# Altium schematic sheet lcd.SchDoc: DE:TMP:11:UC:EXPANDIDO
size 208 x 137 mm; Date: 21-07-2022; SheetNumber: 1; SheetTotal: 1; WebFGR: www.abebashop.com; VersionFGR: 20220721; PageSetup: Record=PageOptions|CenterHorizontal=True|CenterVertical=True|PrintScale=0.94|XCorrection=1.00|YCorrection=1.00|PrintKind=0|BorderSize=5000000|LeftOffset=0|BottomOffset=0|Orientation=2|PaperLength=1000|PaperWidth=1000|Scale=100|PaperSource=7|PrintQuality=-4|MediaType=1|DitherType=10|PaperKind=Letter|PrintScaleMode=1
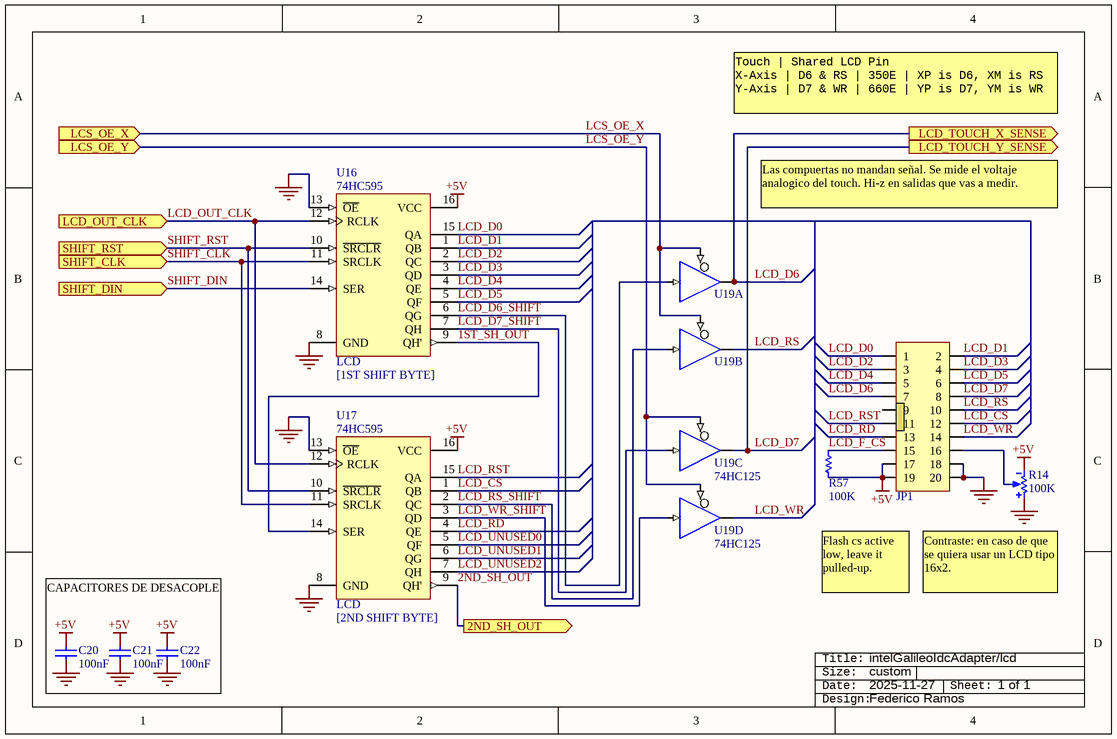
[diagram p0: lcd.SchDoc]

## Parts
C20  value 100nF  [c1206]  (hidden comment: Cap)
C21  value 100nF  [c1206]  (hidden comment: Cap)
C22  value 100nF  [c1206]  (hidden comment: Cap)
JP1  IDC 10x2  [idc10x2]  (value not drawn)
R14  value 100K  [PRESET6]  (hidden comment: Preset)
R57  Resistencia: 100K  [R1206]  (hidden comment: Resistencia 1206; 1Kohm)
ROT?  Rotulo_empty  (value not drawn)  (graphical)
U16  74HC595  [DIP16]
U17  74HC595  [DIP16]
U19  74HC125  [DIP14]  (value not drawn)  (parts A,B,C,D of 4)

## Ports
2ND_SH_OUT (out), LCD_OUT_CLK (in), LCD_TOUCH_X_SENSE (out), LCD_TOUCH_Y_SENSE (out), LCS_OE_X (in), LCS_OE_Y (in), SHIFT_CLK (in), SHIFT_DIN (in), SHIFT_RST (in)

## Nets
+5V: C20.2 C21.2 C22.2 JP1.17 JP1.19 R14.3 R57.1 U16.16(VCC) U17.16(VCC)
GND: C20.1 C21.1 C22.1 JP1.18 JP1.20 R14.1 U16.8(GND) U16.13(~{OE}) U17.8(GND) U17.13(~{OE}) U19.7(GND)
VCC: U19.14(VCC)
1ST_SH_OUT: U16.9(QH') U17.14(SER)
2ND_SH_OUT: U17.9(QH') ; port 2ND_SH_OUT
LCD_CS: JP1.12 U17.1(QB)
LCD_D0: JP1.1 U16.15(QA)
LCD_D1: JP1.2 U16.1(QB)
LCD_D2: JP1.3 U16.2(QC)
LCD_D3: JP1.4 U16.3(QD)
LCD_D4: JP1.5 U16.4(QE)
LCD_D5: JP1.6 U16.5(QF)
LCD_D6: JP1.7 U19.3(Y) ; port LCD_TOUCH_X_SENSE
LCD_D6_SHIFT: U16.6(QG) U19.2(B)
LCD_D7: JP1.8 U19.8(Y) ; port LCD_TOUCH_Y_SENSE
LCD_D7_SHIFT: U16.7(QH) U19.9(B)
LCD_F_CS: JP1.15 R57.2
LCD_OUT_CLK: U16.12(RCLK) U17.12(RCLK) ; port LCD_OUT_CLK
LCD_RD: JP1.13 U17.4(QE)
LCD_RS: JP1.10 U19.6(Y)
LCD_RS_SHIFT: U17.2(QC) U19.5(B)
LCD_RST: JP1.11 U17.15(QA)
LCD_UNUSED0: U17.5(QF)
LCD_UNUSED1: U17.6(QG)
LCD_UNUSED2: U17.7(QH)
LCD_WR: JP1.14 U19.11(Y)
LCD_WR_SHIFT: U17.3(QD) U19.12(B)
LCS_OE_X: U19.1(~{A}) U19.4(~{A}) ; port LCS_OE_X
LCS_OE_Y: U19.10(~{A}) U19.13(~{A}) ; port LCS_OE_Y
SHIFT_CLK: U16.11(SRCLK) U17.11(SRCLK) ; port SHIFT_CLK
SHIFT_DIN: U16.14(SER) ; port SHIFT_DIN
SHIFT_RST: U16.10(~{SRCLR}) U17.10(~{SRCLR}) ; port SHIFT_RST
NetJP1_16: JP1.16 R14.2

Not connected (* = marked no-connect by the designer): JP1 9

## Notes on the sheet
- Touch | Shared LCD Pin
  X-Axis | D6 & RS | 350E | XP is D6, XM is RS
  Y-Axis | D7 & WR | 660E | YP is D7, YM is WR
- Las compuertas no mandan señal. Se mide el voltaje analogico del touch. Hi-z en salidas que vas a medir.
- Flash cs active low, leave it pulled-up.
- Contraste: en caso de que se quiera usar un LCD tipo 16x2.
- CAPACITORES DE DESACOPLE
- intelGalileoIdcAdapter/lcd
- custom
- 2025-11-27
- (near ROT?) 1 of 1
- Federico Ramos
- (in symbol 74HC595) LCD; [2ND SHIFT BYTE]; [1ST SHIFT BYTE]
- (in symbol Rotulo_empty) Title:; Size:; Date:; Sheet:; Design:

## Library data of the parts
C20-C22 = Cap: Capacitor; Voltage: 50V; Price: 0.25; Technology: Ceramic
R14 = Preset: Resistencia Variable
R57 = Resistencia 1206; 1Kohm: Codigo Elemon: RS3886185; Dolares Elemon: 0.00720
ROT? = Rotulo_empty: Rotulo [consolas]
U16 U17 = 74HC595: 8-Bit Shift Register with 3-State Output Registers
U19 = 74HC125: Quad 3-State Non-Inverting Buffer; Price: ?
JP1 = IDC 10x2: Price: ?